# Altium schematic sheet Power Management.SchDoc
size A4; Author: Azmat Bilal; Organization: Shamrock Green; Revision: 1.0.0; SheetNumber: 2; SheetTotal: 4
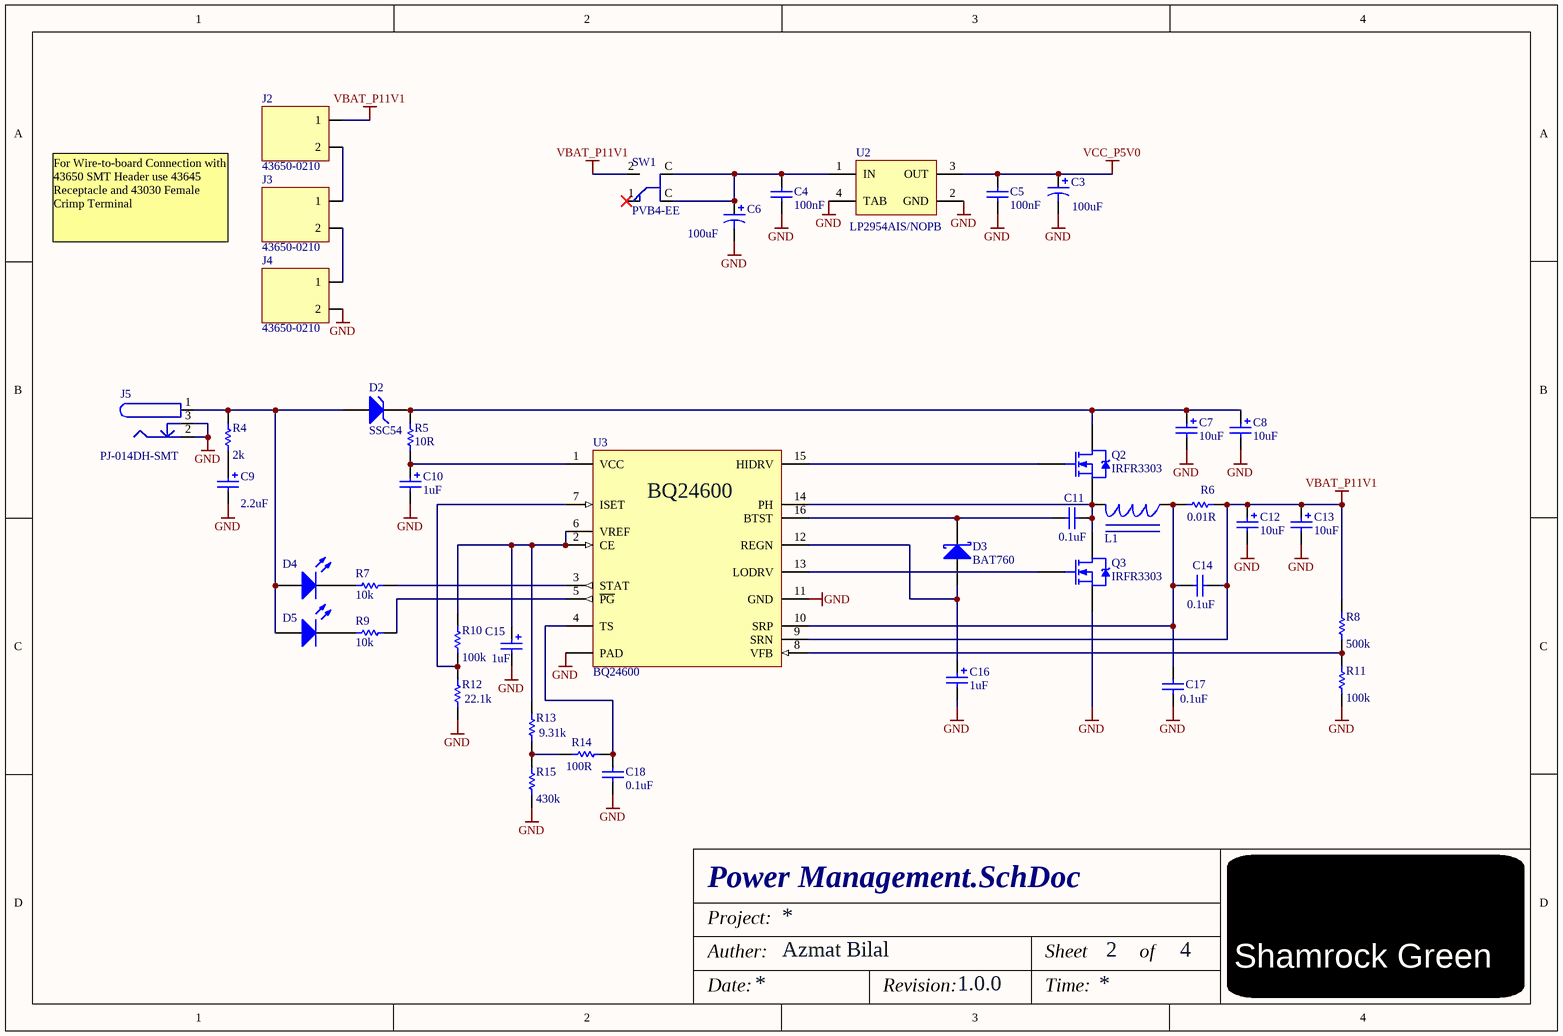
[diagram p0: Power Management.SchDoc]

## Parts
C3  value 100uF  [D]  (hidden comment: T491D107K016AT)
C4  value 100nF  [0603]  (hidden comment: C0603C104K3RACTU)
C5  value 100nF  [0603]  (hidden comment: C0603C104K3RACTU)
C6  value 100uF  [D]  (hidden comment: T491D107K016AT)
C7  value 10uF  [A]  (hidden comment: T491A106K010AT)
C8  value 10uF  [A]  (hidden comment: T491A106K010AT)
C9  value 2.2uF  [A]  (hidden comment: T491A225K010AT)
C10  value 1uF  [M]  (hidden comment: 298D106X06R3M2T)
C11  value 0.1uF  [0603]  (hidden comment: C0603C104K4RACTU)
C12  value 10uF  [A]  (hidden comment: T491A106K010AT)
C13  value 10uF  [A]  (hidden comment: T491A106K010AT)
C14  value 0.1uF  [0603]  (hidden comment: C0603C104K4RACTU)
C15  value 1uF  [M]  (hidden comment: 298D106X06R3M2T)
C16  value 1uF  [M]  (hidden comment: 298D106X06R3M2T)
C17  value 0.1uF  [0603]  (hidden comment: C0603C104K4RACTU)
C18  value 0.1uF  [0603]  (hidden comment: C0603C104K4RACTU)
D2  SSC54  [DO-214AB (SMC)]
D3  BAT760  [SOD323]
D4  HSMA-C190  [1.6X0.8X0.8]  (value not drawn)
D5  HSMG-C190  [1.6X0.8X0.8]  (value not drawn)
J2  43650-0210  [43650-0210]
J3  43650-0210  [43650-0210]
J4  43650-0210  [43650-0210]
J5  PJ-014DH-SMT  [PJ-014DH-SMT]
L1  IHLP2525CZERxRxM11  [IHLP]  (value not drawn)
Q2  IRFR3303  [TO-252AA_N]
Q3  IRFR3303  [TO-252AA_N]
R4  value 2k  [3-0603]  (hidden comment: ERJ3EKF2001V)
R5  value 10R  [8-1206]  (hidden comment: ERJ-8ENF10R0V)
R6  value 0.01R  [M1WS-2512]  (hidden comment: ERJM1WSF10MU)
R7  value 10k  [3-0603]  (hidden comment: ERJ3GEYJ103V)
R8  value 500k  [3-0603]  (hidden comment: ERJ3GEYJ514V)
R9  value 10k  [3-0603]  (hidden comment: ERJ3GEYJ103V)
R10  value 100k  [3-0603]  (hidden comment: ERJ-3GEYJ104V)
R11  value 100k  [3-0603]  (hidden comment: ERJ-3GEYJ104V)
R12  value 22.1k  [3-0603]  (hidden comment: ERJ3EKF2212V)
R13  value 9.31k  [3-0603]  (hidden comment: ERJ3EKF9311V)
R14  value 100R  [3-0603]  (hidden comment: ERJ3GEYJ101V)
R15  value 430k  [3-0603]  (hidden comment: ERJ3GEYJ434V)
SW1  PVB4-EE  [PVB4-EE]
U2  LP2954AIS/NOPB  [TS3B_N]
U3  BQ24600  [QFN16]

## Nets
GND: C3.2 C4.1 C5.1 C6.2 C7.2 C8.2 C9.2 C10.2 C12.2 C13.2 C15.2 C16.2 C17.1 C18.1 J4.2 J5.2 J5.3 Q3.3(S) R11.1 R12.1 R15.1 U2.2(GND) U2.4(TAB) U3.11(GND) U3.17(PAD)
VBAT_P11V1: C12.1 C13.1 C14.2 J2.1 R6.2 R8.2 SW1.2 U3.9(SRN)
VCC_P5V0: C3.1 C5.2 U2.3(OUT)
NetC4_2: C4.2 C6.1 SW1.C U2.1(IN)
NetC7_1: C7.1 C8.1 D2.2(K) Q2.4(D) R5.1
NetC9_1: C9.1 R4.1
NetC10_1: C10.1 R5.2 U3.1(VCC)
NetC11_1: C11.1 D3.1(K) U3.16(BTST)
NetC11_2: C11.2 L1.2 Q2.3(S) Q3.4(D) U3.14(PH)
NetC14_1: C14.1 C17.2 L1.1 R6.1 U3.10(SRP)
NetC15_1: C15.1 R10.2 R13.2 U3.2(CE) U3.6(VREF)
NetC16_1: C16.1 D3.2(A) U3.12(REGN)
NetC18_2: C18.2 R14.2 U3.4(TS)
NetD2_1: D2.1(A) D4.1(A) D5.1(A) J5.1 R4.2
NetD4_2: D4.2(K) R7.2
NetD5_2: D5.2(K) R9.2
NetJ2_2: J2.2 J3.1
NetJ3_2: J3.2 J4.1
NetQ2_1: Q2.1(G) U3.15(HIDRV)
NetQ3_1: Q3.1(G) U3.13(LODRV)
NetR7_1: R7.1 U3.3(STAT)
NetR8_1: R8.1 R11.2 U3.8(VFB)
NetR9_1: R9.1 U3.5(~{PG})
NetR10_1: R10.1 R12.2 U3.7(ISET)
NetR13_1: R13.1 R14.1 R15.2

Not connected (* = marked no-connect by the designer): SW1 1*

## Notes on the sheet
- For Wire-to-board Connection with 43650 SMT Header use 43645 Receptacle and 43030 Female Crimp Terminal
- Project:
- Auther:
- Sheet
- of
- Shamrock Green
- Date:
- Revision:
- Time:

## Library data of the parts
C3 C6 = T491D: Solid Tantalum Chip Capacitor, Standard T491 Series - Industrial Grade; Published: 17-Jul-2002; LatestRevisionDate: 19-Mar-2004; LatestRevisionNote: Silkscreen dimensions re-sized.; DatasheetDocument: Mar-2001; PackageDocument: Mar-2001; PackageReference: D; Publisher: Altium Limited; Code_JEITA: 7343-31; ComponentLink1Description: Manufacturer Link; ComponentLink1URL: http://www.kemet.com/; ComponentLink2Description: Datasheet; ComponentLink2URL: http://www.kemet.com/kemet/web/homepage/kechome.nsf/vapubfilesname/F3102TA.pdf/$file/F3102TA.pdf
C4 C5 C11 C14 C17 C18 = C0603: Ceramic Chip Capacitor - Standard; Note: Footprint corresponds to dimensions for bulk cassette packaging. This case size has tightened tolerances.; Published: 17-Jul-2002; LatestRevisionDate: 19-Mar-2004; LatestRevisionNote: Silkscreen size reduced.; DatasheetDocument: Mar-2001; PackageDocument: Mar-2001; PackageReference: 0603; Publisher: Altium Limited; Code_JEITA: 0603; Code_IPC: 1608 [0603]; ComponentLink1Description: Manufacturer Link; ComponentLink1URL: http://www.kemet.com/; ComponentLink2Description: Datasheet; ComponentLink2URL: http://www.kemet.com/kemet/web/homepage/kechome.nsf/vapubfilesname/F3102TA.pdf/$file/F3102TA.pdf
C7-C9 C12 C13 = T491A: Solid Tantalum Chip Capacitor, Standard T491 Series - Industrial Grade; Published: 17-Jul-2002; LatestRevisionDate: 19-Mar-2004; LatestRevisionNote: Silkscreen dimensions re-sized.; DatasheetDocument: Mar-2001; PackageDocument: Mar-2001; PackageReference: A; Publisher: Altium Limited; Code_JEITA: 3216-18; ComponentLink1Description: Manufacturer Link; ComponentLink1URL: http://www.kemet.com/; ComponentLink2Description: Datasheet; ComponentLink2URL: http://www.kemet.com/kemet/web/homepage/kechome.nsf/vapubfilesname/F3102TA.pdf/$file/F3102TA.pdf
C10 C15 C16 = 298D106X06R3M2T: Solid Tantalum Chip Capacitors  298D microtan, 10uF, 6.3V, 20%,  0603,
D2 = SSC54: High Current Density Schottky Rectifier, 5A, 40V, DO-214AB (SMC)
D3 = BAT760: Schottky Barrier Diode; Published: 17-Sep-2003; LatestRevisionDate: 19-Mar-2004; LatestRevisionNote: Silkscreen size reduced.; DatasheetVersion: 12-Mar-2001; PackageVersion: May-1999; PackageReference: SOD323; Publisher: Altium Limited; PackageDescription: SOD-323/SC-76; 2 Leads; Body 1.7 x 1.3 mm, (LxW); ComponentLink1Description: Manufacturer Link; ComponentLink1URL: http://www.semiconductors.philips.com/; ComponentLink2Description: Datasheet; ComponentLink2URL: http://www.semiconductors.philips.com/acrobat/datasheets/BAT760_2.pdf
D4 D5 = HSMB-C190: Blue Surface Mount Chip LED, Blue; LuminousIntensity: 1.6mcd (Minimum).; PCB_Layout: Complies with manufacturer's recommendation.; Published: 11-Dec-2002; DatasheetVersion: 26-Feb-2002; PackageVersion: Mar-2002; PackageReference: 1.6X0.8X0.8; Publisher: Altium Limited; PackageDescription: SM LED; 2 Flat Leads; LED_Colour: Blue; ComponentLink1Description: Manufacturer Link; ComponentLink1URL: http://www.avagotech.com/; ComponentLink2Description: Datasheet; ComponentLink2URL: http://cp.literature.agilent.com/litweb/pdf/5988-5211EN.pdf
J2-J4 = 43650-0210: Power Connector, Micro-Fit 3.0 Header, SMT, Single Row, Right Angle, 2 Circuits; datasheet: http://www.molex.com/pdm_docs/sd/436500210_sd.pdf; Product Series literature: http://rhu103.sma-promail.com/SQLImages/kelmscott/Molex/PDF_Images/987650-5984.pdf
J5 = PJ-014DH-SMT: DC Power Jack, 1.3 ID 3.5 OD, 3.5A, 24VDC, Normally Closed Switch, SMT, Right Angle; datasheet: http://www.cui.com/product/resource/pj-014dh-smt.pdf
L1 = IHLP2525CZ: Low Profile, High Current IHLP Inductor, 1uH to 22uH, 2.5 to 9A saturation current
Q2 Q3 = IRFR3303: HEXFET Power MOSFET; Note: Pin 2 is trimmed and is electrically connected to Drain.; Published: 8-Jun-2000; LatestRevisionDate: 20-Nov-2009; LatestRevisionNote: IPC-7351 Footprint Added.; DatasheetVersion: Aug-1997; PackageVersion: Feb-2003; PackageReference: TO-252AA; Publisher: Altium Limited; PackageDescription: 3-Pin HEXFET Package 2.28 mm Pitch, 9.9 mm Lead Span; Code_JEDEC: TO-252-AA; ComponentLink1Description: Manufacturer Link; ComponentLink1URL: http://www.irf.com/; ComponentLink2Description: Datasheet; ComponentLink2URL: http://www.irf.com/product-info/datasheets/data/irfr3303.pdf
R4 R12 R13 = ERJ3EK: Precision Thick Film Chip Resistor, 10 Ohm to 1M Ohm Range, 1% and 0.5% Tolerance, 0603 Size, 0.063 W; Published: 17-Dec-2003; LatestRevisionDate: 19-Mar-2004; LatestRevisionNote: Silkscreen size reduced.; PackageDocument: Mar-2003; PackageReference: 3-0603; Publisher: Altium Limited; Code_IPC: 1608 [0603]; ComponentLink1Description: Manufacturer Link; ComponentLink1URL: http://www.panasonic.com/industrial/components/resistive_products.htm; ComponentLink2Description: Datasheet; ComponentLink2URL: http://www.panasonic.com/industrial/components/pdf/AOA0000CE2.pdf
R5 = ERJ8EN: Precision Thick Film Chip Resistor, 10 Ohm to 2.2M Ohm Range, 1% Tolerance, 1206 Size, 0.125 W; Published: 17-Dec-2003; LatestRevisionDate: 19-Mar-2004; LatestRevisionNote: Silkscreen size reduced.; PackageDocument: Mar-2003; PackageReference: 8-1206; Publisher: Altium Limited; Code_IPC: 3216 [1206]; ComponentLink1Description: Manufacturer Link; ComponentLink1URL: http://www.panasonic.com/industrial/components/resistive_products.htm; ComponentLink2Description: Datasheet; ComponentLink2URL: http://www.panasonic.com/industrial/components/pdf/AOA0000CE2.pdf
R6 = ERJM1WS: Low Resistance Value Chip Resistor, 3m Ohm to 20m Ohm Range, 1% and 5% Tolerance, 2512 Size, 1 W; Note: See manufacturer datasheet for alternative land pattern; Published: 17-Dec-2003; LatestRevisionDate: 19-Mar-2004; LatestRevisionNote: Silkscreen size reduced.; PackageDocument: Mar-2003; PackageReference: M1WS-2512; Publisher: Altium Limited; ComponentLink1Description: Manufacturer Link; ComponentLink1URL: http://www.panasonic.com/industrial/components/resistive_products.htm; ComponentLink2Description: Datasheet; ComponentLink2URL: http://www.panasonic.com/industrial/components/pdf/AOA0000CE7.pdf
R7-R11 R14 R15 = ERJ3GE: Thick Film Chip Resistor, 1 Ohm to 10M Ohm Range, 5% Tolerance, 0603 Size, 0.1 W; Note: If flow soldering, adjust pad width of PCB Footprint to 0.7 - 0.8 times the width of the resistor.; Published: 17-Dec-2003; LatestRevisionDate: 19-Mar-2004; LatestRevisionNote: Silkscreen size reduced.; PackageDocument: Mar-2003; PackageReference: 3-0603; Publisher: Altium Limited; Code_IPC: 1608 [0603]; ComponentLink1Description: Manufacturer Link; ComponentLink1URL: http://www.panasonic.com/industrial/components/resistive_products.htm; ComponentLink2Description: Datasheet; ComponentLink2URL: http://www.panasonic.com/industrial/components/pdf/AOA0000CE1.pdf
SW1 = PVB4-EE300NSLFS: Low profile SPDT switch, SMD.
U2 = LP2954AIS/NOPB: 5V Micropower Low-Dropout Voltage Regulator, 3-pin TO-263, Pb-Free; Manufacturer: National Semiconductor; PackageTopMarking: NSUZXYTTE#*LP2954AIS; PowerWise: N; CompType: LDO IC; Published: 1-Mar-2010; DatasheetVersion: Apr-2005; PackageVersion: revF, Apr-2005; PackageReference: TS3B; Publisher: Altium Limited; PackageDescription: TO-263, Molded, .400 x .390 x .180in, 3 Lead, .1in Pitch, Surface Mount; Supplier 1: Digi-Key; Supplier Part Number 1: LP2954AIS-ND; Supplier 2: Farnell; Supplier Part Number 2: 1685547; PartNumber: LP2954AIS/NOPB; RoHS: Y; PinCount: 3; Code_JEDEC: MO-169-AA; ComponentLink1Description: LP2954A Datasheet; ComponentLink1URL: http://www.national.com/ds/LP/LP2954A.pdf; ComponentLink2Description: LP2954A Web Page; ComponentLink2URL: http://www.national.com/pf/LP/LP2954A.html; ComponentLink3Description: TS3B Package Page; ComponentLink3URL: http://www.national.com/packaging/folders/ts3b.html
U3 = BQ24600: Multi-cell Battery Charger IC, Lithium ion and Lithium Polymer, standalone.; datasheet: http://www.ti.com/lit/ds/symlink/bq24600.pdf